# Altium schematic sheet MicroController.SchDoc: MicroController Block Diagram
size A3; DocumentNumber: 14; SheetNumber: 14; SheetTotal: 54
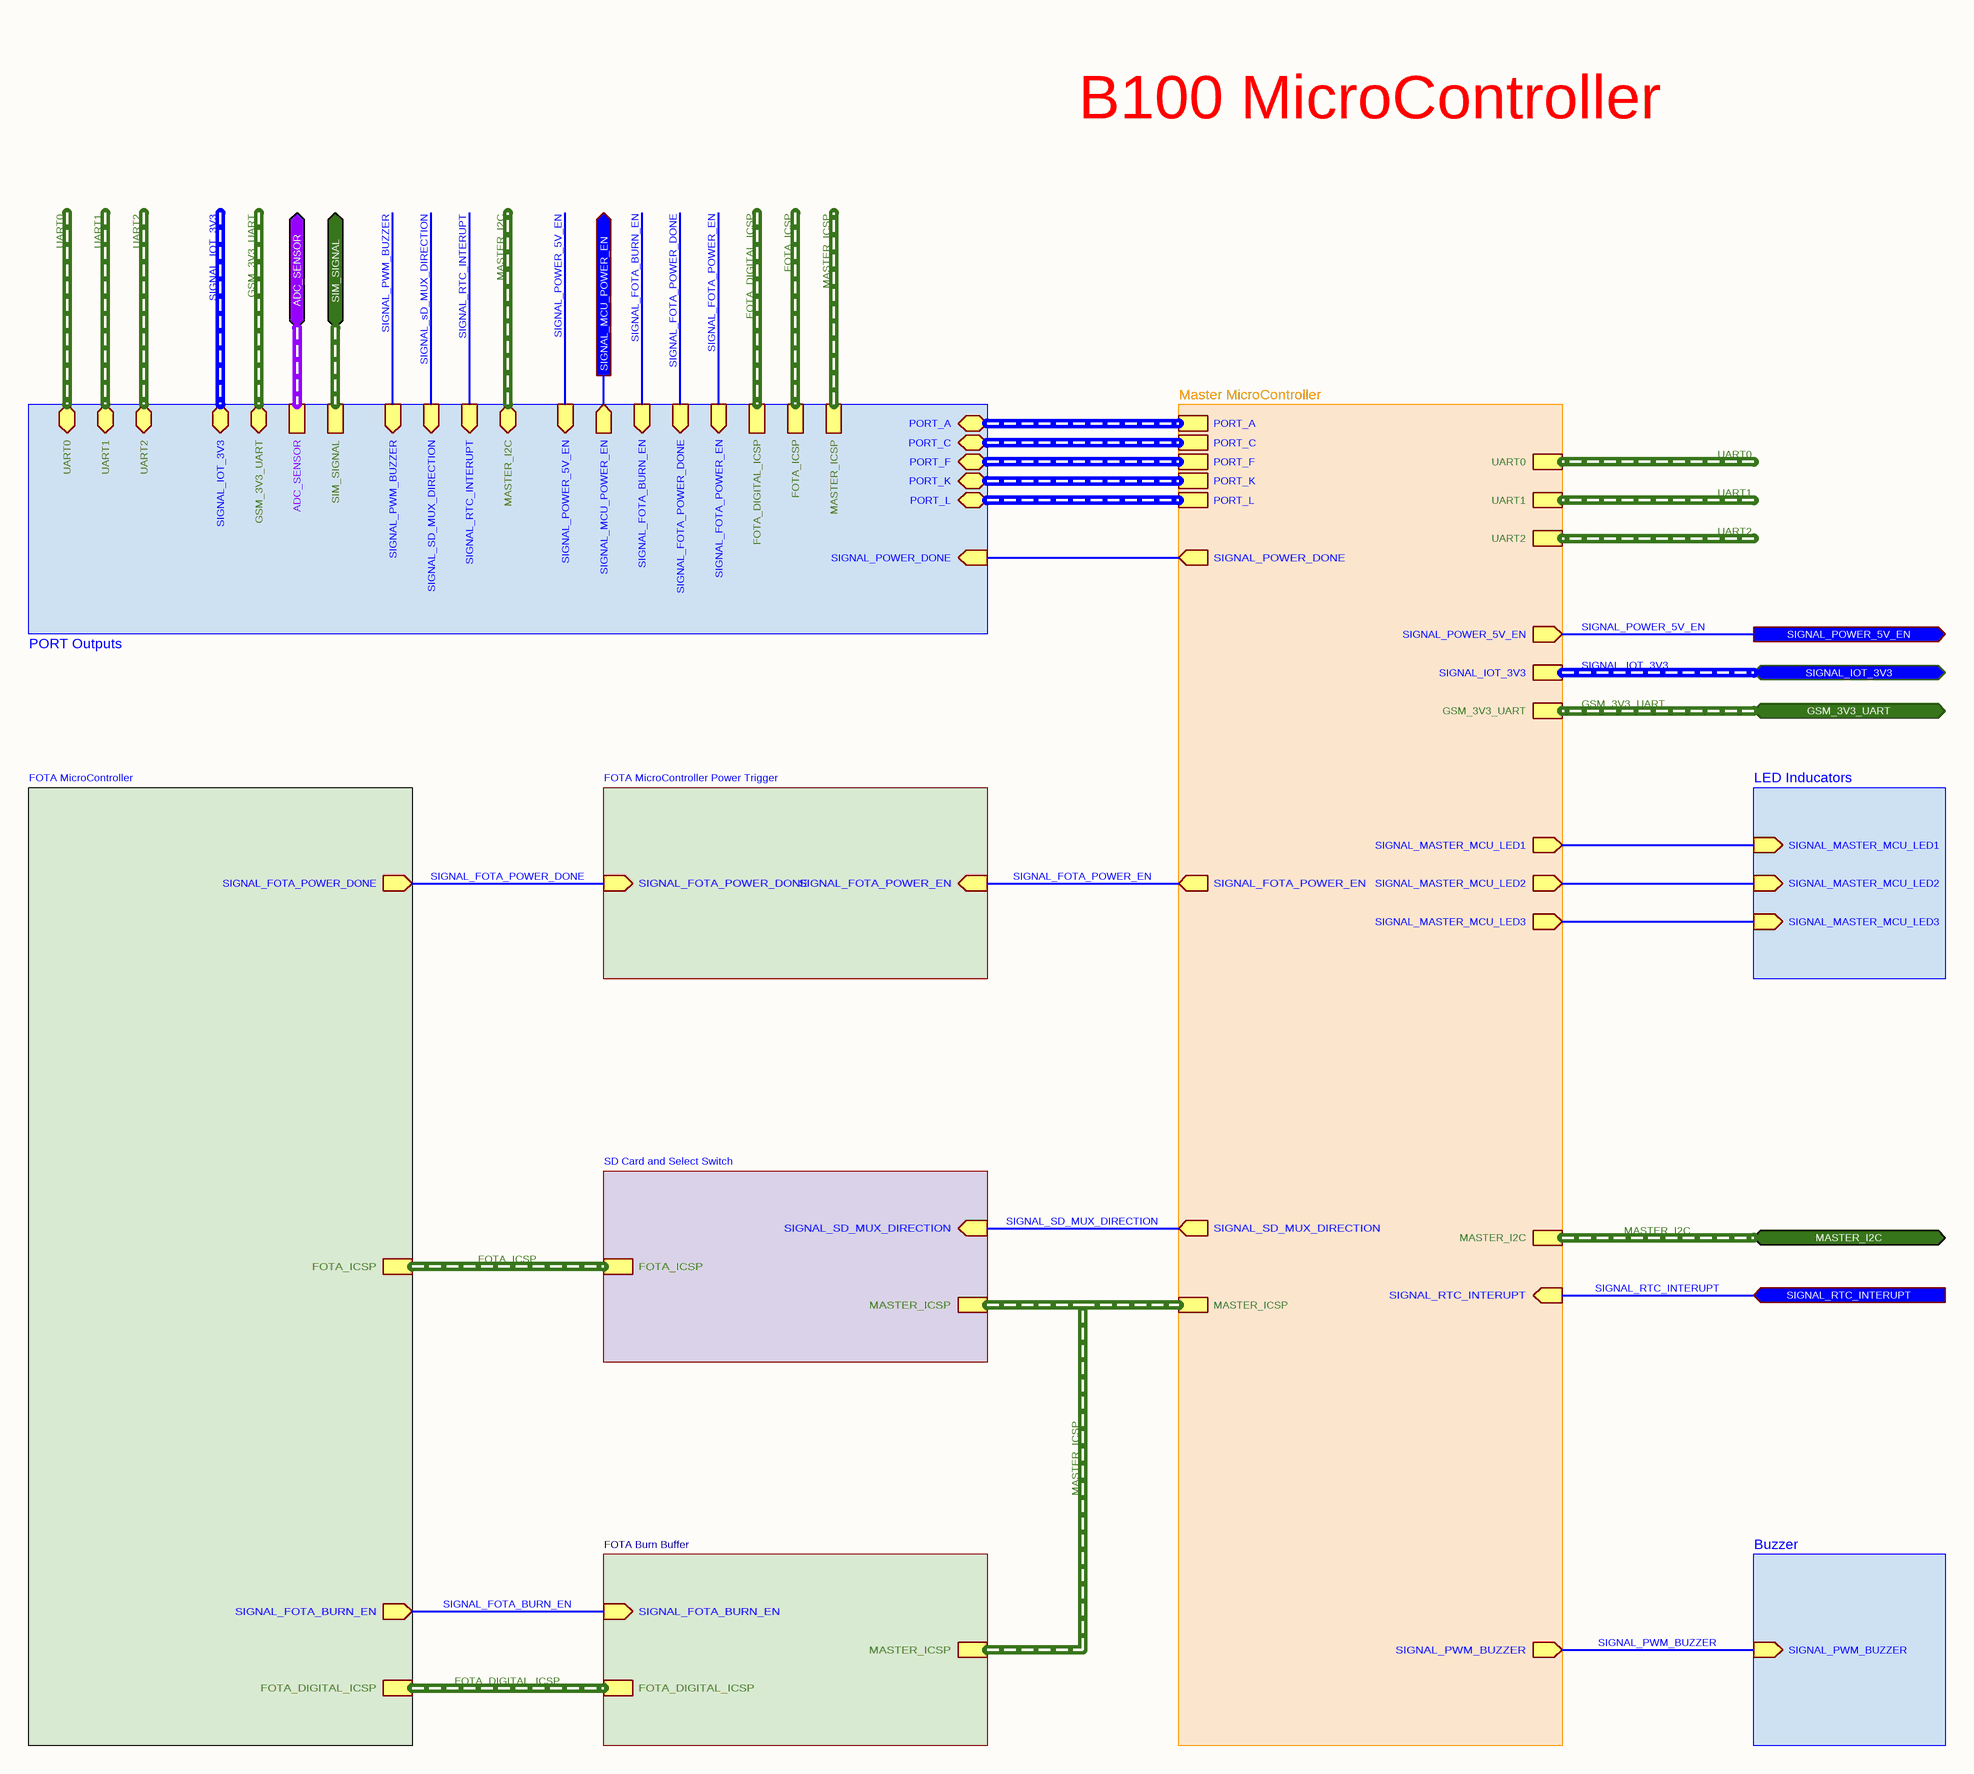
[diagram p0: MicroController.SchDoc]

## Sub-sheets
Buzzer = Buzzer.SchDoc: SIGNAL_PWM_BUZZER (in)
FOTA Burn Buffer = ICSP Burn Buffer.SchDoc: MASTER_ICSP (harness MASTER_ICSP), FOTA_DIGITAL_ICSP (harness FOTA_DIGITAL_ICSP), SIGNAL_FOTA_BURN_EN (in)
FOTA MicroController = FOTA MicroController.SchDoc: SIGNAL_FOTA_POWER_DONE (out), SIGNAL_FOTA_BURN_EN (out), FOTA_ICSP (harness FOTA_ICSP), FOTA_DIGITAL_ICSP (harness FOTA_DIGITAL_ICSP)
FOTA MicroController Power Trigger = FOTA MicroController Power Switch.SchDoc: SIGNAL_FOTA_POWER_DONE (in), SIGNAL_FOTA_POWER_EN (in)
LED Inducators = Master MicroController LED.SchDoc: SIGNAL_MASTER_MCU_LED1 (in), SIGNAL_MASTER_MCU_LED2 (in), SIGNAL_MASTER_MCU_LED3 (in)
Master MicroController = Master MicroController.SchDoc: SIGNAL_FOTA_POWER_EN (out), SIGNAL_POWER_DONE (out), SIGNAL_RTC_INTERUPT (in), SIGNAL_PWM_BUZZER (out), SIGNAL_SD_MUX_DIRECTION (out), UART1 (harness UART1), SIGNAL_MASTER_MCU_LED3 (out), PORT_A (harness PORT_A), UART0 (harness UART0), SIGNAL_MASTER_MCU_LED2 (out), MASTER_ICSP (harness MASTER_ICSP), PORT_K (harness PORT_K), UART2 (harness UART2), PORT_L (harness PORT_L), PORT_F (harness PORT_F), SIGNAL_IOT_3V3 (harness SIGNAL_IOT_3V3), SIGNAL_MASTER_MCU_LED1 (out), GSM_3V3_UART (harness GSM_3V3_UART), PORT_C (harness PORT_C), MASTER_I2C (harness MASTER_I2C), SIGNAL_POWER_5V_EN (out)
PORT Outputs = Module Output Sockets.SchDoc: PORT_A (bidir, harness PORT_A), PORT_F (bidir, harness PORT_F), PORT_C (bidir, harness PORT_C), PORT_K (bidir, harness PORT_K), PORT_L (bidir, harness PORT_L), SIGNAL_POWER_DONE (in), SIGNAL_FOTA_POWER_DONE (in), SIGNAL_FOTA_POWER_EN (in), FOTA_DIGITAL_ICSP (harness FOTA_DIGITAL_ICSP), SIGNAL_FOTA_BURN_EN (in), FOTA_ICSP (harness FOTA_ICSP), UART2 (bidir, harness UART2), UART1 (bidir, harness UART1), UART0 (bidir, harness UART0), MASTER_I2C (bidir, harness MASTER_I2C), MASTER_ICSP (harness MASTER_ICSP), SIGNAL_IOT_3V3 (bidir, harness SIGNAL_IOT_3V3), GSM_3V3_UART (bidir, harness GSM_3V3_UART), SIGNAL_PWM_BUZZER (in), SIGNAL_SD_MUX_DIRECTION (in), SIGNAL_RTC_INTERUPT (in), SIGNAL_MCU_POWER_EN (out), SIM_SIGNAL (harness SIM_SIGNAL), SIGNAL_POWER_5V_EN (in), ADC_SENSOR (harness ADC_SENSOR)
SD Card and Select Switch = SD Card.SchDoc: MASTER_ICSP (harness MASTER_ICSP), FOTA_ICSP (harness FOTA_ICSP), SIGNAL_SD_MUX_DIRECTION (in)

## Ports
ADC_SENSOR (bidir, harness ADC_SENSOR), GSM_3V3_UART (bidir, harness GSM_3V3_UART), MASTER_I2C (bidir, harness MASTER_I2C), SIGNAL_IOT_3V3 (bidir, harness SIGNAL_IOT_3V3), SIGNAL_MCU_POWER_EN (out), SIGNAL_POWER_5V_EN (out), SIGNAL_RTC_INTERUPT (in), SIM_SIGNAL (bidir, harness SIM_SIGNAL)

## Nets
SIGNAL_FOTA_BURN_EN: sheet PORT Outputs/SIGNAL_FOTA_BURN_EN, sheet FOTA Burn Buffer/SIGNAL_FOTA_BURN_EN, sheet FOTA MicroController/SIGNAL_FOTA_BURN_EN
SIGNAL_FOTA_POWER_DONE: sheet PORT Outputs/SIGNAL_FOTA_POWER_DONE, sheet FOTA MicroController Power Trigger/SIGNAL_FOTA_POWER_DONE, sheet FOTA MicroController/SIGNAL_FOTA_POWER_DONE
SIGNAL_FOTA_POWER_EN: sheet Master MicroController/SIGNAL_FOTA_POWER_EN, sheet PORT Outputs/SIGNAL_FOTA_POWER_EN, sheet FOTA MicroController Power Trigger/SIGNAL_FOTA_POWER_EN
SIGNAL_MCU_POWER_EN: port SIGNAL_MCU_POWER_EN, sheet PORT Outputs/SIGNAL_MCU_POWER_EN
SIGNAL_POWER_5V_EN: port SIGNAL_POWER_5V_EN, sheet Master MicroController/SIGNAL_POWER_5V_EN, sheet PORT Outputs/SIGNAL_POWER_5V_EN
SIGNAL_PWM_BUZZER: sheet Master MicroController/SIGNAL_PWM_BUZZER, sheet PORT Outputs/SIGNAL_PWM_BUZZER, sheet Buzzer/SIGNAL_PWM_BUZZER
SIGNAL_RTC_INTERUPT: port SIGNAL_RTC_INTERUPT, sheet Master MicroController/SIGNAL_RTC_INTERUPT, sheet PORT Outputs/SIGNAL_RTC_INTERUPT
SIGNAL_SD_MUX_DIRECTION: sheet Master MicroController/SIGNAL_SD_MUX_DIRECTION, sheet PORT Outputs/SIGNAL_SD_MUX_DIRECTION, sheet SD Card and Select Switch/SIGNAL_SD_MUX_DIRECTION
(unnamed): sheet Master MicroController/SIGNAL_POWER_DONE, sheet PORT Outputs/SIGNAL_POWER_DONE
(unnamed): sheet Master MicroController/SIGNAL_MASTER_MCU_LED3, sheet LED Inducators/SIGNAL_MASTER_MCU_LED3
(unnamed): sheet Master MicroController/SIGNAL_MASTER_MCU_LED2, sheet LED Inducators/SIGNAL_MASTER_MCU_LED2
(unnamed): sheet Master MicroController/SIGNAL_MASTER_MCU_LED1, sheet LED Inducators/SIGNAL_MASTER_MCU_LED1

## Buses and harness runs
harness FOTA_DIGITAL_ICSP = sheet FOTA Burn Buffer/FOTA_DIGITAL_ICSP = sheet FOTA MicroController/FOTA_DIGITAL_ICSP
harness FOTA_DIGITAL_ICSP = sheet PORT Outputs/FOTA_DIGITAL_ICSP
harness FOTA_ICSP = sheet FOTA MicroController/FOTA_ICSP = sheet SD Card and Select Switch/FOTA_ICSP
harness FOTA_ICSP = sheet PORT Outputs/FOTA_ICSP
harness GSM_3V3_UART = port GSM_3V3_UART = sheet Master MicroController/GSM_3V3_UART
harness GSM_3V3_UART = sheet PORT Outputs/GSM_3V3_UART
harness MASTER_I2C = port MASTER_I2C = sheet Master MicroController/MASTER_I2C
harness MASTER_I2C = sheet PORT Outputs/MASTER_I2C
harness MASTER_ICSP = sheet FOTA Burn Buffer/MASTER_ICSP = sheet Master MicroController/MASTER_ICSP = sheet SD Card and Select Switch/MASTER_ICSP
harness MASTER_ICSP = sheet PORT Outputs/MASTER_ICSP
harness port ADC_SENSOR = sheet PORT Outputs/ADC_SENSOR
harness port SIM_SIGNAL = sheet PORT Outputs/SIM_SIGNAL
harness sheet Master MicroController/PORT_A = sheet PORT Outputs/PORT_A
harness sheet Master MicroController/PORT_C = sheet PORT Outputs/PORT_C
harness sheet Master MicroController/PORT_F = sheet PORT Outputs/PORT_F
harness sheet Master MicroController/PORT_K = sheet PORT Outputs/PORT_K
harness sheet Master MicroController/PORT_L = sheet PORT Outputs/PORT_L
harness SIGNAL_IOT_3V3 = port SIGNAL_IOT_3V3 = sheet Master MicroController/SIGNAL_IOT_3V3
harness SIGNAL_IOT_3V3 = sheet PORT Outputs/SIGNAL_IOT_3V3
harness UART0 = sheet Master MicroController/UART0
harness UART0 = sheet PORT Outputs/UART0
harness UART1 = sheet Master MicroController/UART1
harness UART1 = sheet PORT Outputs/UART1
harness UART2 = sheet Master MicroController/UART2
harness UART2 = sheet PORT Outputs/UART2

## Notes on the sheet
- B100 MicroController
- Engineer
- All Rights are reserved to Customer and Engineer. [2021]
- Size:
- Date:
- A3
- Project :
- Time:
- Sheet
- of
- Customer
- Product ID
- Module ID
- Version
- File:
- Revision